# Altium schematic sheet GPIO.SchDoc
size A; SheetNumber: 0; SheetTotal: 0
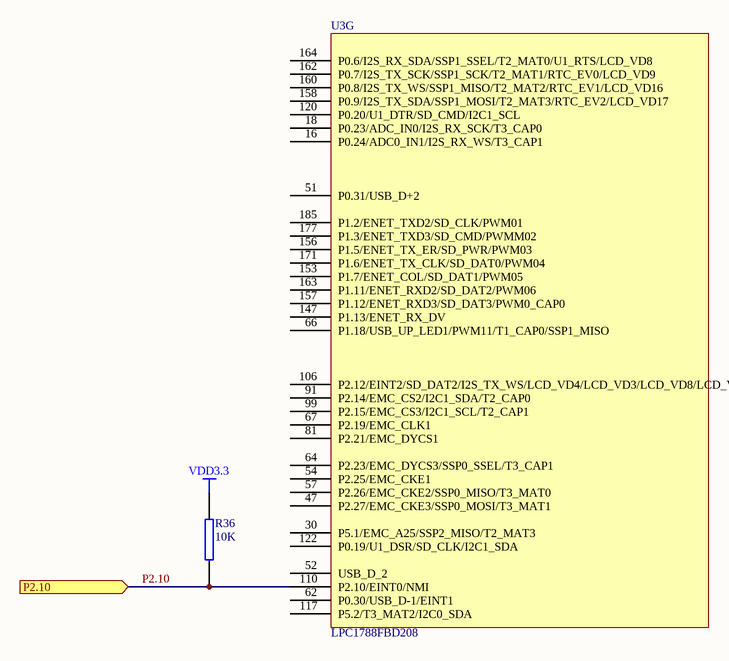
[diagram p0: GPIO.SchDoc]

## Parts
R36  10K  [R0603]
U3  LPC1788FBD208  [QFP208]  (part G of 8)

## Ports
P2.10 (in)

## Nets
VDD3.3: R36.2
P2.10: R36.1 U3.110(P2.10/EINT0/NMI) ; port P2.10

Not connected (* = marked no-connect by the designer): U3 16(P0.24/ADC0_IN1/I2S_RX_WS/T3_CAP1) 18(P0.23/ADC_IN0/I2S_RX_SCK/T3_CAP0) 30(P5.1/EMC_A25/SSP2_MISO/T2_MAT3) 47(P2.27/EMC_CKE3/SSP0_MOSI/T3_MAT1) 51(P0.31/USB_D+2) 52(USB_D_2) 54(P2.25/EMC_CKE1) 57(P2.26/EMC_CKE2/SSP0_MISO/T3_MAT0) 62(P0.30/USB_D-1/EINT1) 64(P2.23/EMC_DYCS3/SSP0_SSEL/T3_CAP1) 66(P1.18/USB_UP_LED1/PWM11/T1_CAP0/SSP1_MISO) 67(P2.19/EMC_CLK1) 81(P2.21/EMC_DYCS1) 91(P2.14/EMC_CS2/I2C1_SDA/T2_CAP0) 99(P2.15/EMC_CS3/I2C1_SCL/T2_CAP1) 106(P2.12/EINT2/SD_DAT2/I2S_TX_WS/LCD_VD4/LCD_VD3/LCD_VD8/LCD_VD18) 117(P5.2/T3_MAT2/I2C0_SDA) 120(P0.20/U1_DTR/SD_CMD/I2C1_SCL) 122(P0.19/U1_DSR/SD_CLK/I2C1_SDA) 147(P1.13/ENET_RX_DV) 153(P1.7/ENET_COL/SD_DAT1/PWM05) 156(P1.5/ENET_TX_ER/SD_PWR/PWM03) 157(P1.12/ENET_RXD3/SD_DAT3/PWM0_CAP0) 158(P0.9/I2S_TX_SDA/SSP1_MOSI/T2_MAT3/RTC_EV2/LCD_VD17) 160(P0.8/I2S_TX_WS/SSP1_MISO/T2_MAT2/RTC_EV1/LCD_VD16) 162(P0.7/I2S_TX_SCK/SSP1_SCK/T2_MAT1/RTC_EV0/LCD_VD9) 163(P1.11/ENET_RXD2/SD_DAT2/PWM06) 164(P0.6/I2S_RX_SDA/SSP1_SSEL/T2_MAT0/U1_RTS/LCD_VD8) 171(P1.6/ENET_TX_CLK/SD_DAT0/PWM04) 177(P1.3/ENET_TXD3/SD_CMD/PWMM02) 185(P1.2/ENET_TXD2/SD_CLK/PWM01)

## Library data of the parts
R36 = RES2